# Altium schematic sheet Radiator.SchDoc: Cooler
size A4; Organization: Zigman Nikita; Address3: zigman.nikita@gmail.com; DocumentNumber: 1.0; Revision: ZN; SheetNumber: 6; SheetTotal: 6
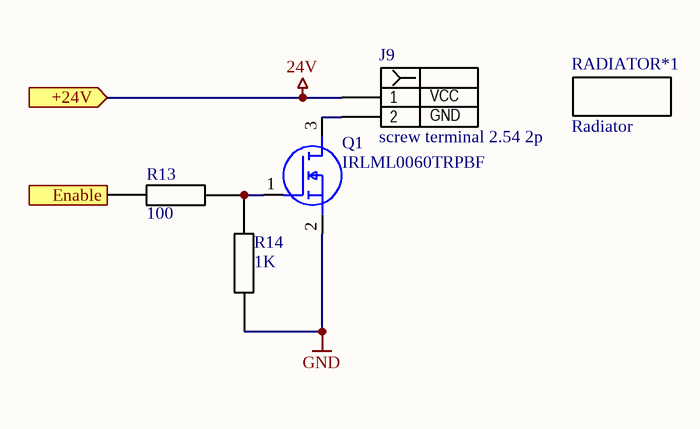
[diagram p0: Radiator.SchDoc]

## Parts
J9  screw terminal 2.54 2p  [1725672-2-2.54]
Q1  IRLML0060TRPBF  [SOT95P237X112-3N]
R13  100  [RESC1608X55N]
R14  1K  [RESC1608X55N]
RADIATOR*1  Radiator  [SK68-75-SA]

## Ports
+24V (in), Enable (in)

## Nets
24V: J9.1 ; port +24V
GND: Q1.2(S) R14.1
Enable: R13.2 ; port Enable
NetJ9_2: J9.2 Q1.3(D)
NetQ1_1: Q1.1(G) R13.1 R14.2

## Notes on the sheet
- Title
- Size:
- Date:
- A4
- Number:
- Time:
- Revision:
- Sheet
- of
- File:
- (in symbol screw terminal 2.54 2p) VCC; GND

## Library data of the parts
J9 = screw terminal 2.54 2p: Connector; Manufacturer_Name: Phoenix Contact; Manufacturer_Part_Number: 1725672; Datasheet Link: https://www.phoenixcontact.com/online/portal/us?uri=pxc-oc-itemdetail:pid=1725672&library=usen&tab=1.pdf; Arrow Part Number: 1725672; Arrow Price/Stock: https://www.arrow.com/en/products/1725672/phoenix-contact; Mouser Part Number: 651-1725672; Mouser Price/Stock: https://www.mouser.co.uk/ProductDetail/Phoenix-Contact/1725672?qs=Ul7CXFMnlWXX93F9bOV2pQ%3D%3D
Q1 = IRLML0060TRPBF: MOSFET (N-Channel); Manufacturer_Name: Infineon; Datasheet Link: https://www.infineon.com/dgdl/irlml0060pbf.pdf?fileId=5546d462533600a40153566493ef25e6; Height: 1.12mm; Manufacturer_Part_Number: IRLML0060TRPBF; Arrow Part Number: IRLML0060TRPBF; Arrow Price/Stock: https://www.arrow.com/en/products/irlml0060trpbf/infineon-technologies-ag; Mouser Part Number: 942-IRLML0060TRPBF; Mouser Price/Stock: https://www.mouser.co.uk/ProductDetail/Infineon-IR/IRLML0060TRPBF?qs=9%252BKlkBgLFf3sC4ri8n%252Bt9Q%3D%3D
R13 = res 0603: 100 0603; Manufacturer_Name: TE Connectivity; Manufacturer_Part_Number: CPF0603B100RE1; Datasheet Link: http://www.farnell.com/datasheets/1786775.pdf; Height: 0.55mm; Arrow Part Number: CPF0603B100RE1; Arrow Price/Stock: https://www.arrow.com/en/products/cpf0603b100re1/te-connectivity; Mouser Part Number: 279-CPF0603B100RE1; Mouser Price/Stock: https://www.mouser.co.uk/ProductDetail/TE-Connectivity-Neohm/CPF0603B100RE1?qs=DfH2yQaBz6s2KWheq2AlNw%3D%3D
R14 = res 0603: 1k 0603; Manufacturer_Name: TE Connectivity; Manufacturer_Part_Number: CPF0603B100RE1; Datasheet Link: http://www.farnell.com/datasheets/1786775.pdf; Height: 0.55mm; Arrow Part Number: CPF0603B100RE1; Arrow Price/Stock: https://www.arrow.com/en/products/cpf0603b100re1/te-connectivity; Mouser Part Number: 279-CPF0603B100RE1; Mouser Price/Stock: https://www.mouser.co.uk/ProductDetail/TE-Connectivity-Neohm/CPF0603B100RE1?qs=DfH2yQaBz6s2KWheq2AlNw%3D%3D